# EAGLE design RedBoard-Qwiic1 (EAGLE 9.6.2)
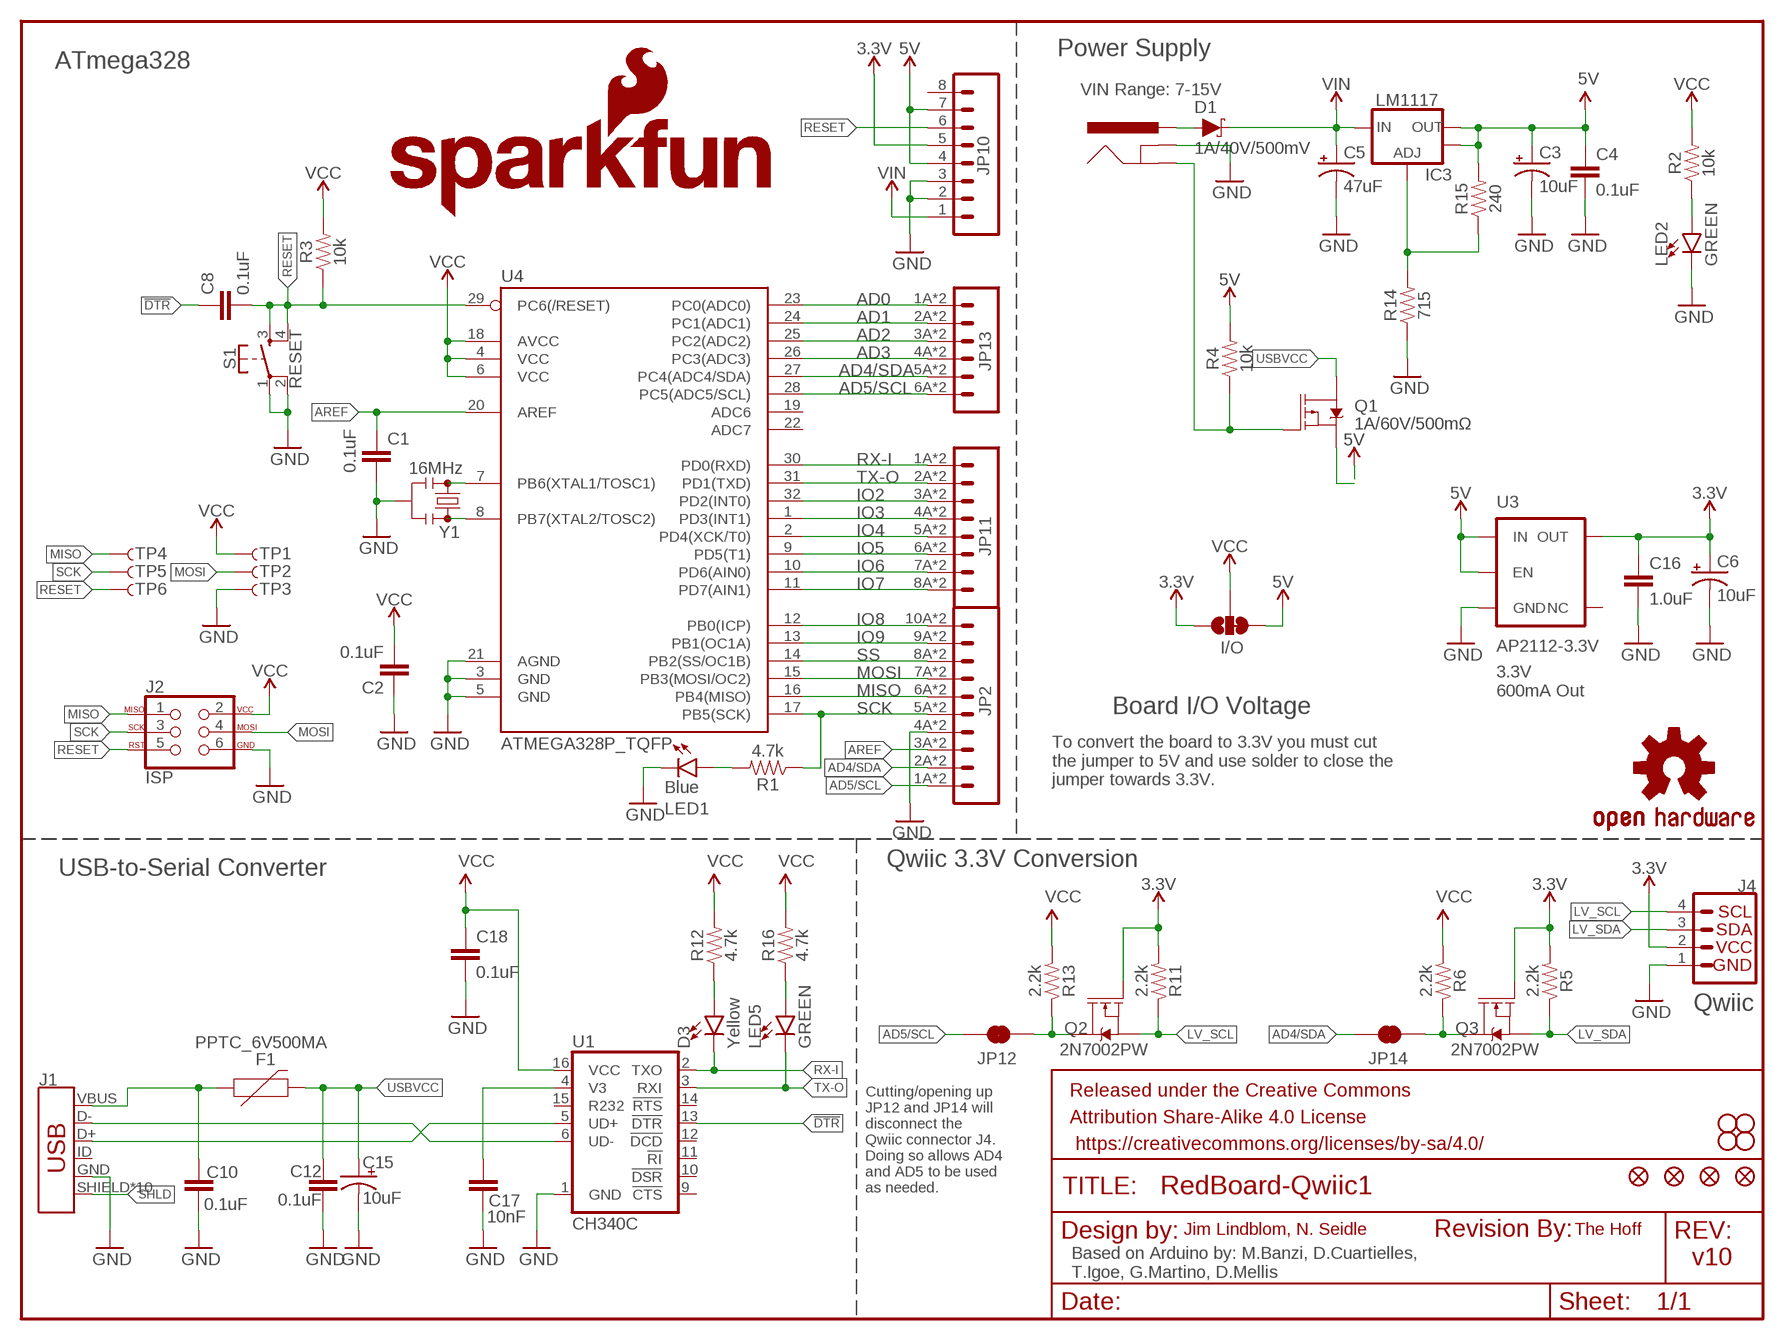
[diagram p0: schematic, sheet 1]

## Parts
C1  0.1uF  0.1UF-0603-25V-(+80/-20%)  [0603]
C2  0.1uF  0.1UF-0603-25V-(+80/-20%)  [0603]
C3  10uF  10UF-POLAR-EIA3216-16V-10%(TANT)  [EIA3216]
C4  0.1uF  0.1UF-0603-25V-(+80/-20%)  [0603]
C5  47uF  47UF-POLAR-PANASONIC_D-35V-20%  [PANASONIC_D]
C6  10uF  10UF-POLAR-EIA3216-16V-10%(TANT)  [EIA3216]
C8  0.1uF  0.1UF-0603-25V-(+80/-20%)  [0603]
C10  0.1uF  0.1UF-0603-25V-(+80/-20%)  [0603]
C12  0.1uF  0.1UF-0603-25V-(+80/-20%)  [0603]
C15  10uF  10UF-POLAR-EIA3216-16V-10%(TANT)  [EIA3216]
C16  1.0uF  1.0UF-16V-10%(0603)  [0603-CAP]
C17  10nF  10NF/10000PF-50V-10%(0603)  [0603-CAP]
C18  0.1uF  0.1UF-0603-25V-(+80/-20%)  [0603]
D1  1A/40V/500mV  DIODE-SCHOTTKY-SS14  [SMA-DIODE]
D3  Yellow  LED-YELLOW_HIDDENSILK  [LED-1206-HIDDENSILK]
F1  PPTC_6V500MA  [0805]
FRAME2  FRAME-LETTER  [CREATIVE_COMMONS]
I/O  JUMPER-SMT_3_1-NC_TRACE_SILK  [SMT-JUMPER_3_1-NC_TRACE_SILK]
IC3  LM1117  V_REG_LM1117ALT1  [SOT223-ALT1]
J1  AMP FCI 10103594-0001LF  USB_MICRO-B_HALF_PTH_MILL  [USB-MICROB-PTH-MILL]
J2  ISP  AVR_SPI_PROG_3X2SMD  [2X3_SMT_POSTS]
J3  POWER_JACKSUPER_BOMB_DIGITY  [POWER_JACK_SMD_OVERPASTE_SUPER_BOMB_DIGITY]
J4  QWIIC_CONNECTORJS-1MM  [1X04_1MM_RA]
JP1  SFE_LOGO_NAME.1_INCH  [SFE_LOGO_NAME_.1]
JP2  M10SMD_COMBO  [1X10_SMD_COMBINED]
JP3  STAND-OFF  [STAND-OFF]
JP4  STAND-OFF  [STAND-OFF]
JP5  STAND-OFF  [STAND-OFF]
JP6  STAND-OFF  [STAND-OFF]
JP7  SFE_LOGO_FLAME.1_INCH  [SFE_LOGO_FLAME_.1]
JP8  FIDUCIAL1X2  [FIDUCIAL-1X2]
JP9  FIDUCIAL1X2  [FIDUCIAL-1X2]
JP10  CONN_08SMD-COMBO-FEMALE  [1X08_SMD_COMBINED]
JP11  JP11  M08SMD-COMBO  [1X08_SMD_COMBINED@1]
JP12  JUMPER-SMT_2_NC_TRACE_SILK  [SMT-JUMPER_2_NC_TRACE_SILK]
JP13  M06SMD-STRAIGHT-COMBO  [1X06_SMD_STRAIGHT_COMBO]
JP14  JUMPER-SMT_2_NC_TRACE_SILK  [SMT-JUMPER_2_NC_TRACE_SILK]
JP15  FIDUCIAL1X2  [FIDUCIAL-1X2]
JP16  FIDUCIAL1X2  [FIDUCIAL-1X2]
LED1  Blue  LED-BLUE_HIDDENSILK  [LED-1206-HIDDENSILK]
LED2  GREEN  LED-GREEN_HIDDENSILK  [LED-1206-HIDDENSILK]
LED5  GREEN  LED-GREEN_HIDDENSILK  [LED-1206-HIDDENSILK]
LOGO1  REVISION  [REVISION]
Q1  1A/60V/500mΩ  MOSFET-PCH-ZXMP6A13F  [SOT23-3]
Q2  2N7002PW  MOSFET-NCH-2N7002PW  [SOT323]
Q3  2N7002PW  MOSFET-NCH-2N7002PW  [SOT323]
R1  4.7k  4.7KOHM-0603-1/10W-1%  [0603]
R2  10k  10KOHM-0603-1/10W-1%  [0603]
R3  10k  10KOHM-0603-1/10W-1%  [0603]
R4  10k  10KOHM-0603-1/10W-1%  [0603]
R5  2.2k  2.2KOHM-0603-1/10W-1%  [0603]
R6  2.2k  2.2KOHM-0603-1/10W-1%  [0603]
R11  2.2k  2.2KOHM-0603-1/10W-1%  [0603]
R12  4.7k  4.7KOHM-0603-1/10W-1%  [0603]
R13  2.2k  2.2KOHM-0603-1/10W-1%  [0603]
R14  715  715OHM-0603-1/10W-1%  [0603]
R15  240  240OHM-0603-1/10W-1%  [0603]
R16  4.7k  4.7KOHM-0603-1/10W-1%  [0603]
S1  RESET  MOMENTARY-SWITCH-SPST-2-SMD-5.2MM-TALL  [TACTILE_SWITCH_SMD_5.2MM]
TP1  TP-3x5  TEST-POINT3X5  [PAD.03X.05]
TP2  TP-3x5  TEST-POINT3X5  [PAD.03X.05]
TP3  TP-3x5  TEST-POINT3X5  [PAD.03X.05]
TP4  TP-3x5  TEST-POINT3X5  [PAD.03X.05]
TP5  TP-3x5  TEST-POINT3X5  [PAD.03X.05]
TP6  TP-3x5  TEST-POINT3X5  [PAD.03X.05]
U1  CH340C  [SO016]
U3  AP2112-3.3V  V_REG_AP2112K-3.3V  [SOT23-5]
U4  ATMEGA328P_TQFP  [TQFP32-08]
U$16  OSHW-LOGOS  [OSHW-LOGO-S]
Y1  16MHz  RESONATOR-16MHZSMD_3.2X1.3  [RESONATOR-SMD-3.2X1.3]

## Nets
3.3V: C6.+ C16.1 I/O.1 J4.2 JP10.5 Q2.1(G) Q3.1(G) R5.2 R11.2 U3.5(OUT)
5V: C3.+ C4.1 I/O.3 IC3.2(OUT) IC3.4(OUT) JP10.4 JP10.7 Q1.2(S) R4.2 R15.2 U3.1(IN) U3.3(EN)
!DTR: C8.1 U1.13(!DTR)
AD0: JP13.1A JP13.1B U4.23(PC0(ADC0))
AD1: JP13.2A JP13.2B U4.24(PC1(ADC1))
AD2: JP13.3A JP13.3B U4.25(PC2(ADC2))
AD3: JP13.4A JP13.4B U4.26(PC3(ADC3))
AD4/SDA: JP2.2A JP2.2B JP13.5A JP13.5B JP14.2 U4.27(PC4(ADC4/SDA))
AD5/SCL: JP2.1A JP2.1B JP12.2 JP13.6A JP13.6B U4.28(PC5(ADC5/SCL))
AREF: C1.1 JP2.3A JP2.3B U4.20(AREF)
GND: C1.2 C2.1 C3.- C4.2 C5.- C6.- C10.2 C12.2 C15.- C16.2 C17.2 C18.2 J1.GND J2.6 J3.GND(GNDBREAK) J4.1 JP2.4A JP2.4B JP10.2 JP10.3 LED1.C LED2.C R14.1 S1.1 S1.2 TP3.P$1 U1.1(GND) U3.2(GND) U4.3(GND) U4.5(GND) U4.21(AGND) Y1.2
INSERT: J3.P$4(GND) Q1.1(G) R4.1
IO2: JP11.3A JP11.3B U4.32(PD2(INT0))
IO3: JP11.4A JP11.4B U4.1(PD3(INT1))
IO4: JP11.5A JP11.5B U4.2(PD4(XCK/T0))
IO5: JP11.6A JP11.6B U4.9(PD5(T1))
IO6: JP11.7A JP11.7B U4.10(PD6(AIN0))
IO7: JP11.8A JP11.8B U4.11(PD7(AIN1))
IO8: JP2.10A JP2.10B U4.12(PB0(ICP))
IO9: JP2.9A JP2.9B U4.13(PB1(OC1A))
LV_SCL: J4.4 Q2.2(S) R11.1
LV_SDA: J4.3 Q3.2(S) R5.1
MISO: J2.1 JP2.6A JP2.6B TP4.P$1 U4.16(PB4(MISO))
MOSI: J2.4 JP2.7A JP2.7B TP2.P$1 U4.15(PB3(MOSI/OC2))
N$1: LED1.A R1.2
N$2: LED2.A R2.1
N$3: U4.7(PB6(XTAL1/TOSC1)) Y1.1
N$4: U4.8(PB7(XTAL2/TOSC2)) Y1.3
N$5: LED5.A R16.1
N$6: C17.1 U1.4(V3)
N$7: JP12.1 Q2.3(D) R13.1
N$8: JP14.1 Q3.3(D) R6.1
N$9: D3.A R12.1
N$13: J1.D- U1.6(UD-)
N$14: J1.D+ U1.5(UD+)
N$15: IC3.1(ADJ) R14.2 R15.1
PWRIN: D1.A J3.VIN0(PWR)
RESET: C8.2 J2.5 JP10.6 R3.1 S1.3 S1.4 TP6.P$1 U4.29(PC6(/RESET))
RX-I: D3.C JP11.1A JP11.1B U1.2(TXO) U4.30(PD0(RXD))
SCK: J2.3 JP2.5A JP2.5B R1.1 TP5.P$1 U4.17(PB5(SCK))
SHLD: J1.SHIELD J1.SHIELD2(SHIELD) J1.SHIELD3(SHIELD) J1.SHIELD4(SHIELD) J1.SHIELD5(SHIELD) J1.SHIELD6(SHIELD) J1.SHIELD7(SHIELD) J1.SHIELD8(SHIELD) J1.SHIELD9(SHIELD) J1.SHIELD10(SHIELD)
SS: JP2.8A JP2.8B U4.14(PB2(SS/OC1B))
TX-O: JP11.2A JP11.2B LED5.C U1.3(RXI) U4.31(PD1(TXD))
USBVCC: C12.1 C15.+ F1.2 Q1.3(D)
VCC: C2.2 C18.1 I/O.2 J2.2 R2.2 R3.2 R6.2 R12.2 R13.2 R16.2 TP1.P$1 U1.16(VCC) U4.4(VCC) U4.6(VCC) U4.18(AVCC)
VIN: C5.+ D1.C IC3.3(IN) JP10.1
VUSB: C10.1 F1.1 J1.VBUS
Unconnected: J1.ID JP10.8 U1.9(!CTS) U1.10(!DSR) U1.11(!RI) U1.12(!DCD) U1.14(!RTS) U1.15(R232) U3.4(NC) U4.19(ADC6) U4.22(ADC7)

## Notes on the sheet
- Power Supply
- ATmega328
- VIN Range: 7-15V
- 3.3V
  600mA Out
- Board I/O Voltage
- To convert the board to 3.3V you must cut
  the jumper to 5V and use solder to close the
  jumper towards 3.3V.
- Qwiic 3.3V Conversion
- USB-to-Serial Converter
- Qwiic
- Cutting/opening up
  JP12 and JP14 will 
  disconnect the 
  Qwiic connector J4.  
  Doing so allows AD4 
  and AD5 to be used
  as needed.
- Jim Lindblom, N. Seidle | The Hoff
- v10
- Based on Arduino by: M.Banzi, D.Cuartielles, 
  T.Igoe, G.Martino, D.Mellis

## Library data of the parts
C1 C2 C4 C8 C10 C12 C18 = SparkFun-Capacitors:0.1UF: 0.1µF ceramic capacitors A capacitor is a passive two-terminal electrical component used to store electrical energy temporarily in an electric field.; PROD_ID: CAP-00810
C3 C6 C15 = SparkFun-Capacitors:10UF-POLAR: 10.0µF polarized capacitors A capacitor is a passive two-terminal electrical component used to store electrical energy temporarily in an electric field.; PROD_ID: CAP-00811
C5 = SparkFun-Capacitors:47UF-POLAR: 47µF polarized capacitors A capacitor is a passive two-terminal electrical component used to store electrical energy temporarily in an electric field.; PROD_ID: CAP-08478
C16 = SparkFun-Capacitors:1.0UF-16V-10%(0603): CAP-00868; PROD_ID: CAP-00868
C17 = SparkFun-Capacitors:10NF/10000PF-50V-10%(0603): CAP-00867; PROD_ID: CAP-00867
D1 = SparkFun-DiscreteSemi:DIODE-SCHOTTKY: Schottky diode A Schottky diode is a semiconductor diode which has a low forward voltage drop and a very fast switching action.; PROD_ID: DIO-08053
D3 = SparkFun-LED:LED-YELLOW: Yellow SMD LED Used in manufacturing several products at SparkFun. Packages: 0603 - SMD 0603 package[Product Link] <http://www.kingbrightusa.com/product.asp?catalog_name=LED&product_id=APT1608SYCK> 0603 -SMART - SMART SMD 0603 package (more efficient/more expensive) [Product Link] <http://www.osram-os.com/osram_os/en/products/product-catalog/led-light-emitting-diodes/smartled-0603/ly-l29k/index.jsp> LilyPad - SMD1206 package[Product Datasheet] <https://www.sparkfun.com/datasheets/DevTools/LilyPad/Q150YUS4.pdf> SparkFun Products: Blynk Board <https://www.sparkfun.com/products/13794> IOIO-OTG <https://www.sparkfun.com/products/13613> XBee Explorer Serial <https://www.sparkfun.com/products/13225>; PROD_ID: DIO-09909
F1 = SparkFun-Fuses:PPTC: Resettable Fuse PPTC Resettable Fuse. Really a sort of resistor with a polymeric positive temperature coefficient whose resistance increases dramatically with an increase in temperature. When heated by the power passing through the resistance rises causing the current to be limited, protecting the circuit. This is achieved by the transition of the polymer from a crystalline to an amorphous state where the conductive carbon separates breaking the conductive pathways found in the cool crystalline structure. When a PPTC cools back down it resumes conducting letting the circuit turn back on. SparkFun Products: SparkFun RedBoard - Programmed with Arduino Pro Micro - 5V/16MHz Arduino Pro 328 - 5V/16MHz MP3 Trigger
FRAME2 = SparkFun-Aesthetics:FRAME-LETTER: Schematic Frame - Letter Standard 8.5x11 US Letter frame
I/O = SparkFun-Jumpers:JUMPER-SMT_3_1-NC_TRACE: Normally closed trace jumper (1 of 2 connections) This jumper has a trace between two pads so it's normally closed (NC). The other connection is normally open (NO). Use a razor knife to open the connection. For best results follow the IPC guidelines for cutting traces: Cutout at least 0.063 mm (0.005 in). Remove all loose material to clean up the cut area. Seal the cut with an approved epoxy. Reapply solder to reclose the connection, or to close the NO connection.
IC3 = Testing:V_REG_LM1117: Voltage Regulator LM1117 Standard adjustable voltage regulator but in SMD form. Spark Fun Electronics SKU : COM-00595; PROD_ID: VREG-08170
J1 = SparkFun-Connectors:USB_MICRO-B: USB Type Micro-B Connector Male/female and PTH/SMT variants SparkFun Products: SparkFun microB USB Breakout <https://www.sparkfun.com/products/12035> SparkFun USB microB Plug Breakout <https://www.sparkfun.com/products/10031> SparkFun ESP8266 Thing <https://www.sparkfun.com/products/13231>; PROD_ID: CONN-13711
J2 = SparkFun-Connectors:AVR_SPI_PROG_3X2: AVR ISP 6 Pin This is the reduced ISP connector for AVR programming. Common on Arduino. This footprint will take up less PCB space and can be used with a 10-pin to 6-pin adapter such as SKU: BOB-08508 **Special note about "TEST_POINT" package. The stop mask is on the top side, so if you want your programming test points to be on the bottom of your board, make sure to place this package on the bottom side of the board. This also ensure that the orientation to program from the bottom side will be correct.; PROD_ID: CONN-11415
J3 = Testing:POWER_JACK: Power Jack This is the standard 5.5mm barrel jack for power. The PTH is the most common, proven, reliable, footprint. All others are experimental. The Slot footprint only works if the mill layer is transmitted to the PCB fab house so be warned. Spark Fun Electronics SKU : PRT-00119. Mating wall wart : TOL-00298 (and others); PROD_ID: CONN-08106
J4 = SparkFun-Connectors:QWIIC_CONNECTOR: SparkFun I2C Standard Qwiic Connector An SMD 1mm pitch JST connector makes it easy and quick (get it? Qwiic?) to connect I2C devices to each other. The Qwiic system <http://www.sparkfun.com/qwiic> enables fast and solderless connection between popular platforms and various sensors and actuators. We carry 200mm <https://www.sparkfun.com/products/14204>, 100mm <https://www.sparkfun.com/products/14205>, 50mm <https://www.sparkfun.com/products/14206>, and breadboard friendly <https://www.sparkfun.com/products/14207> Qwiic cables. We also offer 10 pcs strips <https://www.sparkfun.com/products/14323> the SMD connectors.; PROD_ID: CONN-13694
JP1 = SparkFun-Aesthetics:SFE_LOGO_NAME: SFE Logo, name only This is the SparkFun name logo. The logo on the schematic will always be the same size; the package variant is the height of the flame part of the logo (or the height the flame would be, if it were drawn). Default layer for the logo on the board is tSilk.
JP2 = SparkFun-Connectors:M10: Header 10 Standard 10-pin 0.1" header. Use with straight break away headers (SKU : PRT-00116), right angle break away headers (PRT-00553), swiss pins (PRT-00743), machine pins (PRT-00117), and female headers (PRT-00115).; PROD_ID: CONN-11219
JP3-JP6 = SparkFun:STAND-OFF: Stand Off This is the mechanical footprint for a #4 phillips button head screw. Use the keepout ring to avoid running the screw head into surrounding components. SKU : PRT-00447
JP7 = SparkFun-Aesthetics:SFE_LOGO_FLAME: SFE Logo, flame only This is the SparkFun flame logo. The logo on the schematic will always be the same size; the package variant is the height of the flame. Default layer for the logo on the board is tSilk.
JP8 JP9 JP15 JP16 = SparkFun:FIDUCIAL: Fiducial Alignment Points Various fiducial points for machine vision alignment.
JP10 = SparkFun-Connectors:CONN_08: Multi connection point. Often used as Generic Header-pin footprint for 0.1 inch spaced/style header connections On any of the 0.1 inch spaced packages, you can populate with these: Break Away Headers - Straight (PRT-00116) Break Away Male Headers - Right Angle (PRT-00553) Female Headers (PRT-00115) Break Away Headers - Machine Pin (PRT-00117) Break Away Female Headers - Swiss Machine Pin (PRT-00743) Arduino Stackable Header - 8 Pin (PRT-09279) For SCREWTERMINALS and SPRING TERMINALS visit here: Screw Terimnals on SparkFun.com (5mm/3.5mm/2.54mm spacing) This device is also useful as a general connection point to wire up your design to another part of your project. Our various solder wires solder well into these plated through hole pads. Hook-Up Wire - Assortment (Stranded, 22 AWG) (PRT-11375) Hook-Up Wire - Assortment (Solid Core, 22 AWG) (PRT-11367) View the entire wire category on our website here Special notes: Molex polarized connector foot print use with SKU : PRT-08231 with associated crimp pins and housings. 1MM SMD Version SKU: PRT-10208 NOTES ON THE VARIANTS LOCK and LOCK_LONGPADS... This footprint was designed to help hold the alignment of a through-hole component (i.e. 6-pin header) while soldering it into place. You may notice that each hole has been shifted either up or down by 0.005 of an inch from it's more standard position (which is a perfectly straight line). This slight alteration caused the pins (the squares in the middle) to touch the edges of the holes. Because they are alternating, it causes a "brace" to hold the component in place. 0.005 has proven to be the perfect amount of "off-center" position when using our standard breakaway headers. Although looks a little odd when you look at the bare footprint, once you have a header in there, the alteration is very hard to notice. Also,if you push a header all the way into place, it is covered up entirely on the bottom side.; PROD_ID: CONN-10204; SF_ID: PRT-11543
JP11 = SparkFun-Connectors:M08: Header 8 Standard 8-pin 0.1" header. Use with straight break away headers (SKU : PRT-00116), right angle break away headers (PRT-00553), swiss pins (PRT-00743), machine pins (PRT-00117), and female headers (PRT-00115).; PROD_ID: CONN-10204
JP12 JP14 = SparkFun-Jumpers:JUMPER-SMT_2_NC_TRACE: Normally closed trace jumper This jumper has a trace between two pads so it's normally closed (NC). Use a razor knife to open the connection. For best results follow the IPC guidelines for cutting traces: Cutout at least 0.063 mm (0.005 in). Remove all loose material to clean up the cut area. Seal the cut with an approved epoxy. Reapply solder to reclose the connection.
JP13 = SparkFun-Connectors:M06: Header 6 Standard 6-pin 0.1" header. Use with straight break away headers (SKU : PRT-00116), right angle break away headers (PRT-00553), swiss pins (PRT-00743), machine pins (PRT-00117), and female headers (PRT-00115). Molex polarized connector foot print use with SKU : PRT-08094 with associated crimp pins and housings. NOTES ON THE VARIANTS LOCK and LOCK_LONGPADS... This footprint was designed to help hold the alignment of a through-hole component (i.e. 6-pin header) while soldering it into place. You may notice that each hole has been shifted either up or down by 0.005 of an inch from it's more standard position (which is a perfectly straight line). This slight alteration caused the pins (the squares in the middle) to touch the edges of the holes. Because they are alternating, it causes a "brace" to hold the component in place. 0.005 has proven to be the perfect amount of "off-center" position when using our standard breakaway headers. Although looks a little odd when you look at the bare footprint, once you have a header in there, the alteration is very hard to notice. Also,if you push a header all the way into place, it is covered up entirely on the bottom side. This idea of altering the position of holes to aid alignment will be further integrated into the Sparkfun Library for other footprints. It can help hold any component with 3 or more connection pins.; PROD_ID: CONN-10203
LED1 = SparkFun-LED:LED-BLUE: Blue SMD LED Used in manufacturing of various products at SparkFun Packages: 0603 - SMD 0603 package [Product Link] <http://www.digikey.com/product-detail/en/SMLE12BC7TT86/511-1589-2-ND/1641808> 1206 - SMD1206 package [Product Link] <http://www.digikey.com/product-detail/en/lite-on-inc/LTST-C150TBKT/160-1643-1-ND/573584> SparkFun Products: ESP8266 Thing-Dev Board <https://www.sparkfun.com/products/13711> RedBoard <https://www.sparkfun.com/products/12757>; PROD_ID: DIO-09911
LED2 = SparkFun-LED:LED-GREEN: Green SMD LED Used in manufacturing of various products at SparkFun Packages: 0603 - SMD 0603 package [Product Link] <http://www.futureelectronics.com/en/technologies/semiconductors/optoelectronics/leds/Pages/9894312-LTST-C190GKT.aspx?CrossPart=HSMG-C190&IM=0> LilyPad 1206 - SMD1206 LilyPad package [Product Link] <http://www.futureelectronics.com/en/Technologies/Product.aspx?ProductID=IN150NGHARVATEKCORPORATION2049943&IM=0> 1206 - SMD1206 package [Product Link] <http://www.futureelectronics.com/en/technologies/semiconductors/optoelectronics/leds/Pages/8315665-LTST-C150KGKT.aspx?IM=0> 1206 Bottom Mount -SMD 1206 Bottom Mount [Product Link] <http://www.digikey.com/product-detail/en/lite-on-inc/LTST-C230KGKT/160-1456-1-ND/386854> SparkFun Products: Pro Mini 328 -5V <https://www.sparkfun.com/products/821> RedBoard <https://www.sparkfun.com/products/12757> MP3 Trigger <https://www.sparkfun.com/products/13720> Makey Makey <https://www.sparkfun.com/products/11076>; PROD_ID: DIO-09910
LED5 = SparkFun-LED:LED-GREEN: Green SMD LED Used in manufacturing of various products at SparkFun Packages: 0603 - SMD 0603 package [Product Link] <http://www.futureelectronics.com/en/technologies/semiconductors/optoelectronics/leds/Pages/9894312-LTST-C190GKT.aspx?CrossPart=HSMG-C190&IM=0> LilyPad 1206 - SMD1206 LilyPad package [Product Link] <http://www.futureelectronics.com/en/Technologies/Product.aspx?ProductID=IN150NGHARVATEKCORPORATION2049943&IM=0> 1206 - SMD1206 package [Product Link] <http://www.futureelectronics.com/en/technologies/semiconductors/optoelectronics/leds/Pages/8315665-LTST-C150KGKT.aspx?IM=0> 1206 Bottom Mount -SMD 1206 Bottom Mount [Product Link] <http://www.digikey.com/product-detail/en/lite-on-inc/LTST-C230KGKT/160-1456-1-ND/386854> SparkFun Products: Pro Mini 328 -5V <https://www.sparkfun.com/products/821> RedBoard <https://www.sparkfun.com/products/12757> MP3 Trigger <https://www.sparkfun.com/products/13720> Makey Makey <https://www.sparkfun.com/products/11076>; PROD_ID: DIO-00862
LOGO1 = SparkFun-Aesthetics:REVISION: "Revision By" Text Preceding text for revisor documentation. Includes schematic text on "symbols" layer, and board text on tDoc.
Q1 = SparkFun-DiscreteSemi:MOSFET-PCH: P-channel MOSFETs Voltage controlled devices that allow control of high current outputs.; PROD_ID: TRANS-08285
Q2 Q3 = SparkFun-DiscreteSemi:MOSFET-NCH: N-channel MOSFETs Voltage controlled devices that allow control of high current outputs.; PROD_ID: TRANS-11151; VALUE: 310mA/60V/1.6Ω
R1 R12 R16 = SparkFun-Resistors:4.7KOHM: 4.7kΩ resistor A resistor is a passive two-terminal electrical component that implements electrical resistance as a circuit element. Resistors act to reduce current flow, and, at the same time, act to lower voltage levels within circuits. - Wikipedia; PROD_ID: RES-07857
R2-R4 = SparkFun-Resistors:10KOHM: 10kΩ resistor A resistor is a passive two-terminal electrical component that implements electrical resistance as a circuit element. Resistors act to reduce current flow, and, at the same time, act to lower voltage levels within circuits. - Wikipedia; PROD_ID: RES-00824
R5 R6 R11 R13 = SparkFun-Resistors:2.2KOHM: 2.2kΩ resistor A resistor is a passive two-terminal electrical component that implements electrical resistance as a circuit element. Resistors act to reduce current flow, and, at the same time, act to lower voltage levels within circuits. - Wikipedia; PROD_ID: RES-08272
R14 = SparkFun-Resistors:715OHM: 715Ω resistor A resistor is a passive two-terminal electrical component that implements electrical resistance as a circuit element. Resistors act to reduce current flow, and, at the same time, act to lower voltage levels within circuits.; PROD_ID: RES-07850
R15 = SparkFun-Resistors:240OHM: 240Ω resistor A resistor is a passive two-terminal electrical component that implements electrical resistance as a circuit element. Resistors act to reduce current flow, and, at the same time, act to lower voltage levels within circuits.; PROD_ID: RES-07849
S1 = SparkFun-Switches:MOMENTARY-SWITCH-SPST-2: Momentary Switch (Pushbutton) - SPST - Two Circuits Normally-open (NO) SPST momentary switches (buttons, pushbuttons). Schematic symbol includes two switch circuits. Variants SMD-4.6MMX2.8MM - 4.60mm x 2.80mm Tactile Momentary Button Switch - Used on SparkFun SAMD21 Mini Breakout SMD-5.2MM - Mini Pushbutton Switch - SMD - Used on Arduino Pro Mini; PROD_ID: SWCH-14139
TP1-TP4 TP6 = SparkFun-Connectors:TEST-POINT: Bare copper test points for troubleshooting or ICT
TP5 = SparkFun-Passives:TEST-POINT: Bare copper test points for troubleshooting or ICT
U1 = SparkFun-IC-Comms:CH340C; PROD_ID: IC-14038
U3 = SparkFun-PowerIC:V_REG_AP2112: AP2112 - 600mA CMOS LDO Regulator w/ Enable The AP2112 is CMOS process low dropout linear regulator with enable function, the regulator delivers a guaranteed 600mA (min.) continuous load current. Features Output Voltage Accuracy: ±1.5% Output Current: 600mA (Min.) Foldback Short Current Protection: 50mA Enable Function to Turn ON/OFF VOUT Low Dropout Voltage (3.3V): 250mV (Typ.) @IOUT=600mA Excellent Load Regulation: 0.2%/A (Typ.) Excellent Line Regulation: 0.02%/V (Typ.) Low Quiescent Current: 55μA (Typ.) Low Standby Current: 0.01μA (Typ.) Low Output Noise: 50μVRMS PSRR: 100Hz -65dB, 1kHz -65dB OTSD Protection Stable with 1.0μF Flexible Cap: Ceramic, Tantalum and Aluminum Electrolytic Operation Temperature Range: -40°C to 85°C ESD: MM 400V, HBM 4000V; PROD_ID: VREG-12457; VALUE: 3.3V
U4 = SparkFun-IC-Microcontroller:ATMEGA328P_TQFP; PROD_ID: IC-09069
U$16 = SparkFun-Aesthetics:OSHW-LOGO: Open Source Hardware Logo This logo indicates the piece of hardware it is found on incorporates a OSHW license and/or adheres to the definition of open source hardware found here: http://freedomdefined.org/OSHW
Y1 = SparkFun-Clocks:RESONATOR-16MHZ: 16MHz Resonator Digikey Example <http://www.digikey.com/product-detail/en/murata-electronics-north-america/CSTCE16M0V53-R0/490-1198-1-ND/584635> Frequency: 16MHz Frequency Stability: ±0.3% Frequency Tolerance: ±0.5% Capacitance: 15pF; PROD_ID: XTAL-08900

## Net classes
1 power: width 0.178 mm

## Board
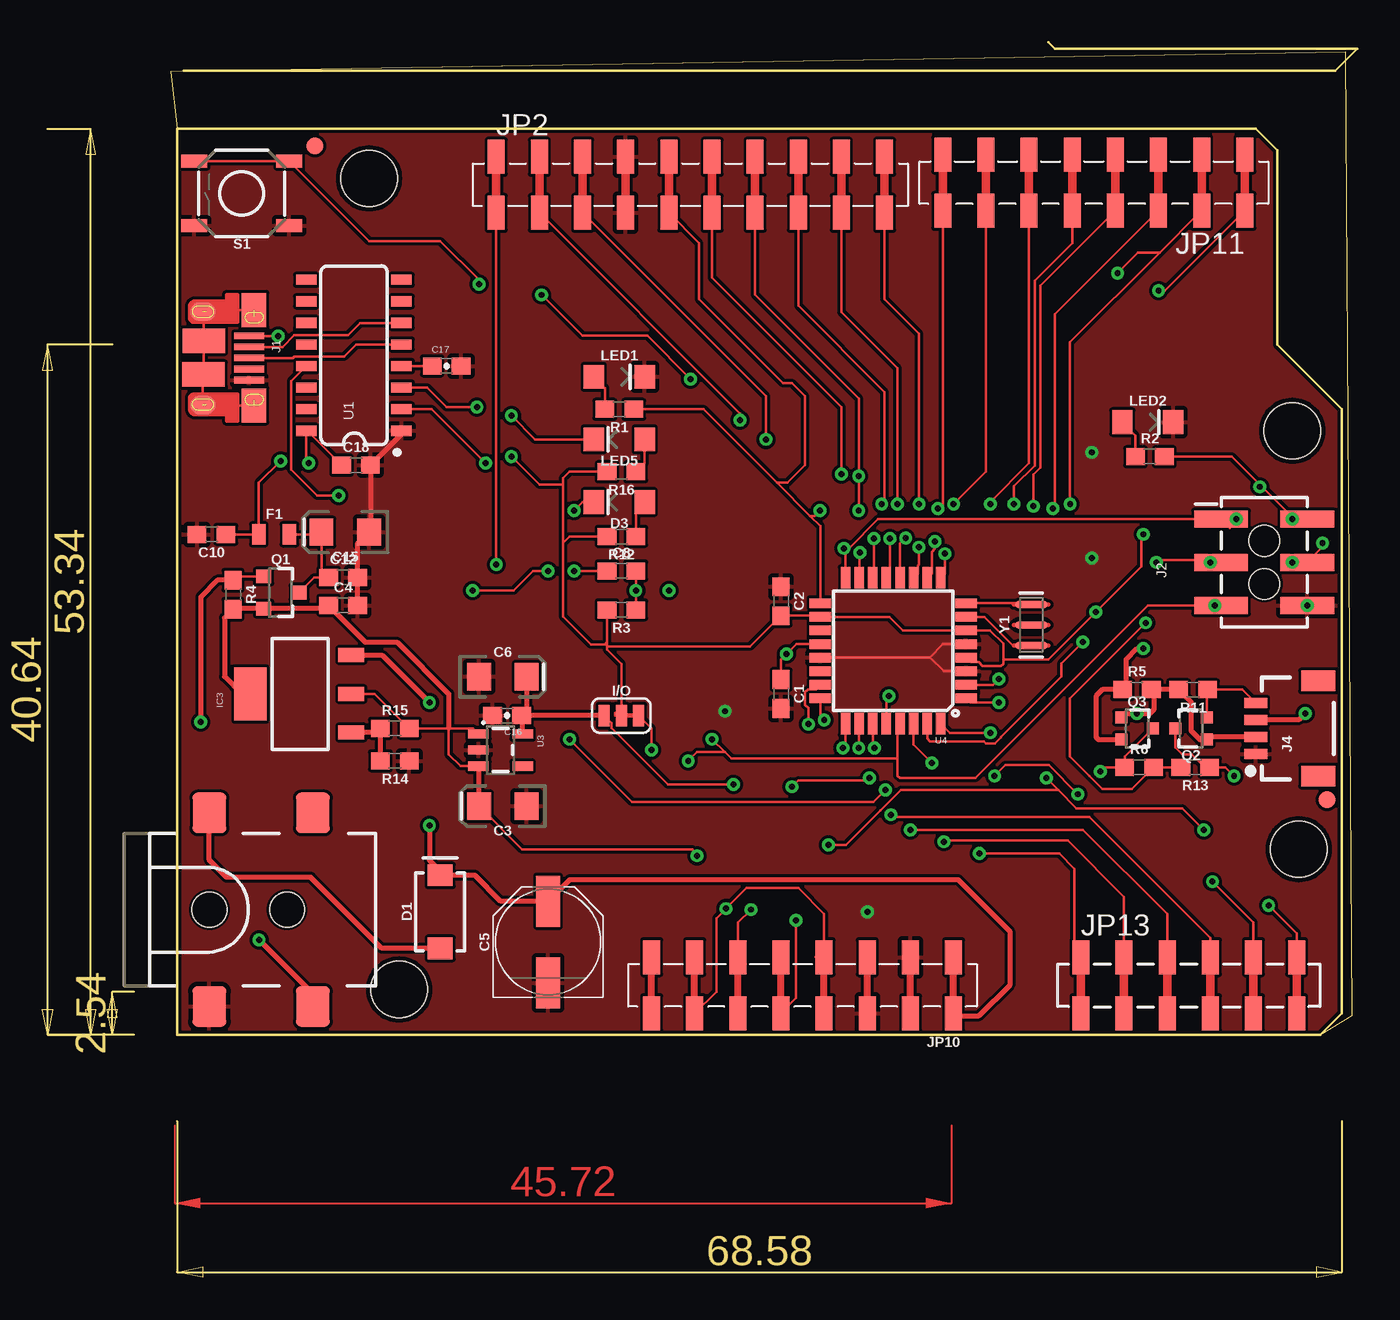
[diagram p1: board, top side]
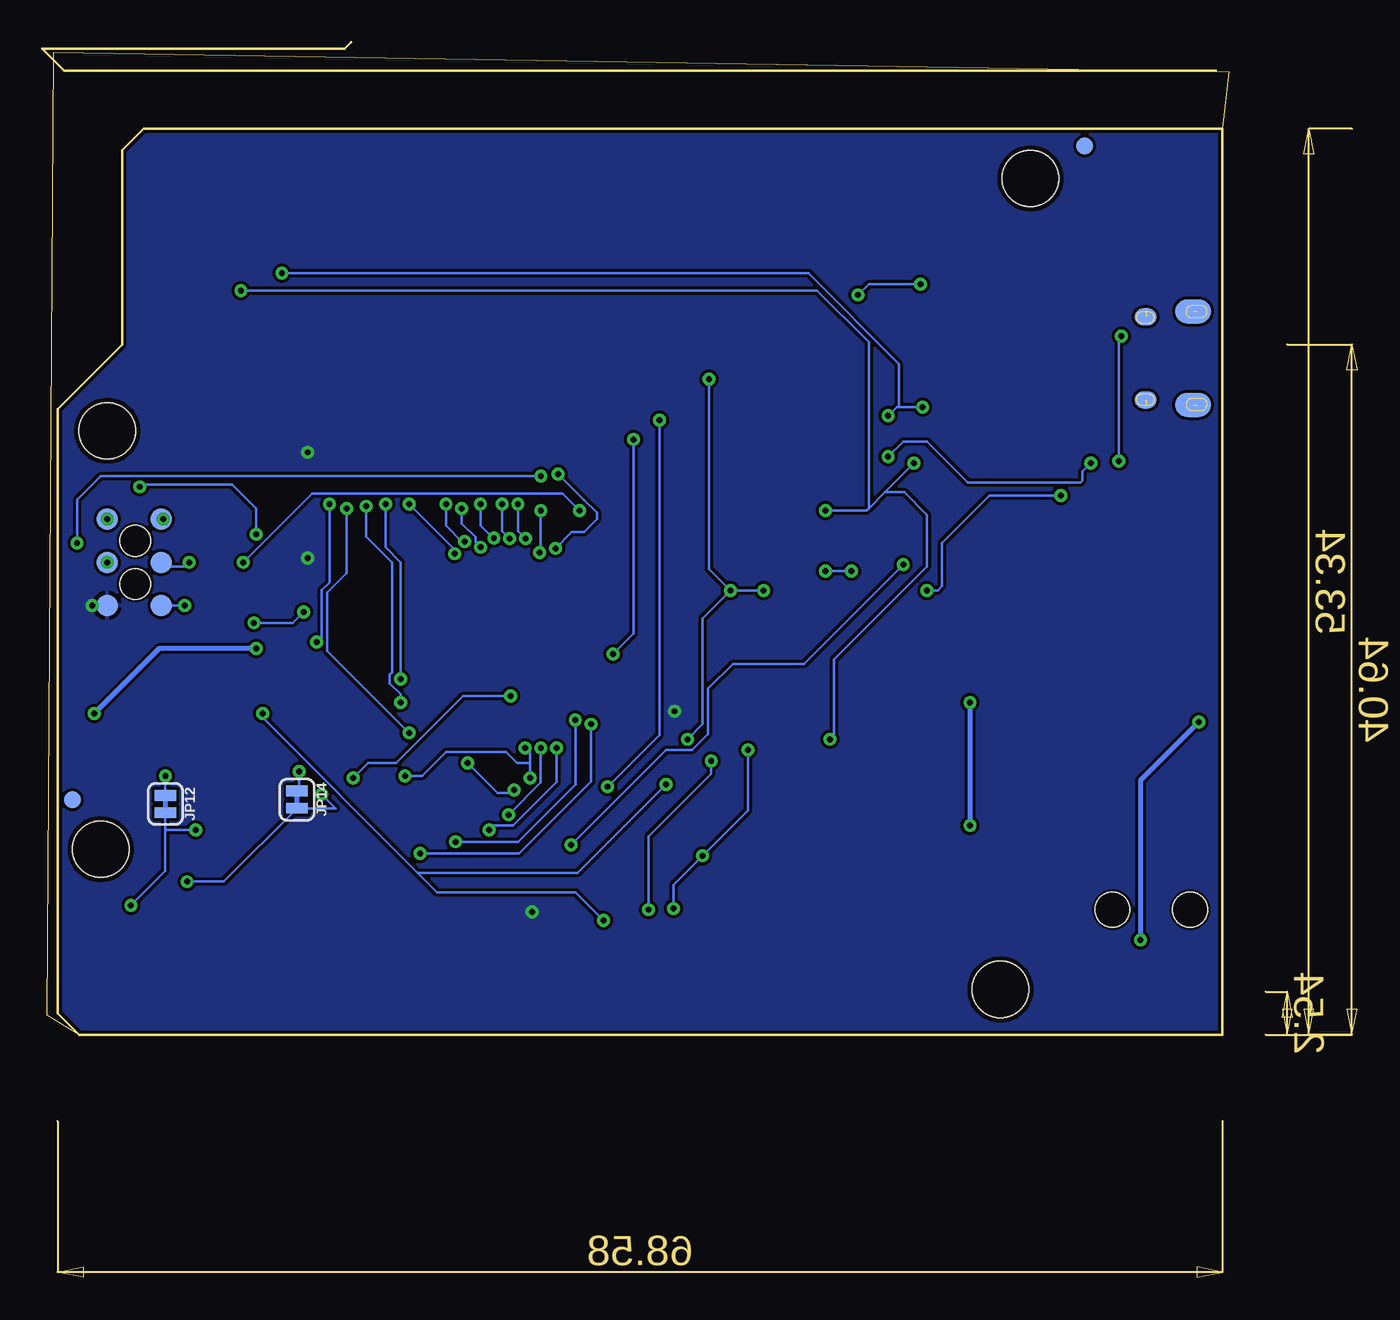
[diagram p2: board, bottom side, seen from below]

Size 69.85 x 58.42 mm. Coordinates in mm from the lower left corner, seen from the top.
Outline: 67.69,0 69.58,1.14 69.19,57.84 0,56.69 0.38,53.34
Outline: 0.38,53.34 63.88,53.34 65.15,52.07 65.15,40.64 68.96,36.83 68.96,1.27 67.69,0
Outline: 67.69,0 0.38,0 0.38,53.34
Outline: 0.76,56.77 68.58,56.77 69.85,58.04 52.07,58.04 51.69,58.42
Copper layers (1*16): Top 0.035mm / dielectric 1.5mm / Bottom 0.035mm
Design rules "default *": minimum track width 6mil, minimum drill 0.35mm, track to track 7mil, track to pad 7mil, pad to pad 7mil, via to via 7mil, smd to smd 7mil, copper to edge 7mil, drill to drill 7mil, minimum pad ring 10mil, minimum via ring 8mil, stop-mask expansion 4mil, vias tented up to drill 0mil, thermal gap 10mil

### Footprints (pad centres in the part's own frame; a part is rotated, then mirrored left to right if it is on the bottom)
0603 = smd 1.1 x 1: 1 -0.85,0; 2 0.85,0
EIA3216 = smd 1.4 x 1.6: + 1.4,0; - -1.4,0
PANASONIC_D = smd 3 x 1.4: + 2.4,0; - -2.4,0
0603-CAP = smd 1.1 x 1: 1 -0.85,0; 2 0.85,0
SMA-DIODE = smd 1.27 x 1.47: A -2.15,0; C 2.15,0
LED-1206-HIDDENSILK = smd 1.2 x 1.4: A -1.5,0; C 1.5,0
0805 = smd 0.8 x 1.2: 1 -0.9,0; 2 0.9,0
SMT-JUMPER_3_1-NC_TRACE_SILK = smd 0.635 x 1.27: 1 -1.016,0; 2 0,0; 3 1.016,0
SOT223-ALT1 = smd 0.813 x 1.524: 1 -2.271,-3.02; 2 0,-3.02; 3 2.288,-3.02 | smd 3.124 x 1.905: 4 0,2.921
USB-MICROB-PTH-MILL = smd 0.4 x 1.75: D+ 0.031,1.331; D- -0.619,1.331; GND 1.331,1.331; ID 0.681,1.331; VBUS -1.269,1.331 | smd 2 x 1.46: SHIELD -2.794,1.606; SHIELD2 2.831,1.606 | smd 1.425 x 2.5: SHIELD3 -0.979,-1.349; SHIELD4 0.996,-1.352 | smd 1.4 x 2.1 bottom: SHIELD5 -2.7,-1.2; SHIELD7 2.8,-1.2 | smd 1.1 x 1.5: SHIELD6 2.8,-1.4; SHIELD8 -2.7,-1.4 | smd 1 x 1.3 bottom: SHIELD9 -2.4,1.6; SHIELD10 2.5,1.6
2X3_SMT_POSTS = smd 1 x 3.17: 1 -2.54,-2.54; 2 -2.54,2.54; 3 0,-2.54; 4 0,2.54; 5 2.54,-2.54; 6 2.54,2.54 | hole 1.8: -1.27,0; 1.27,0
POWER_JACK_SMD_OVERPASTE_SUPER_BOMB_DIGITY = smd 2 x 2.4: GND 0,-5.7; P$4 6.1,-5.7; VIN0 0,5.7; VIN1 6.1,5.7 | hole 2.032: 0,0; 4.572,0
1X04_1MM_RA = smd 0.6 x 1.35: 1 -1.5,0; 2 -0.5,0; 3 0.5,0; 4 1.5,0 | smd 1.2 x 2: NC1 2.8,-3.675; NC2 -2.8,-3.675
1X10_SMD_COMBINED = smd 1 x 2: 1A 0,1.65; 1B 0,-1.65; 2A 2.54,1.65; 2B 2.54,-1.65; 3A 5.08,1.65; 3B 5.08,-1.65; 4A 7.62,1.65; 4B 7.62,-1.65; 5A 10.16,1.65; 5B 10.16,-1.65; 6A 12.7,1.65; 6B 12.7,-1.65; 7A 15.24,1.65; 7B 15.24,-1.65; 8A 17.78,1.65; 8B 17.78,-1.65; 9A 20.32,1.65; 9B 20.32,-1.65; 10A 22.86,1.65; 10B 22.86,-1.65
STAND-OFF = hole 3.302: 0,0
FIDUCIAL-1X2 = smd 1 x 1: 1 0,0
1X08_SMD_COMBINED = smd 1 x 2: 1 0,1.65; 1@2 0,-1.65; 2 2.54,-1.65; 2@2 2.54,1.65; 3 5.08,1.65; 3@2 5.08,-1.65; 4 7.62,-1.65; 4@2 7.62,1.65; 5 10.16,1.65; 5@2 10.16,-1.65; 6 12.7,-1.65; 6@2 12.7,1.65; 7 15.24,1.65; 7@2 15.24,-1.65; 8 17.78,-1.65; 8@2 17.78,1.65
1X08_SMD_COMBINED@1 = smd 1 x 2: 1A 0,1.65; 1B 0,-1.65; 2A 2.54,-1.65; 2B 2.54,1.65; 3A 5.08,1.65; 3B 5.08,-1.65; 4A 7.62,-1.65; 4B 7.62,1.65; 5A 10.16,1.65; 5B 10.16,-1.65; 6A 12.7,-1.65; 6B 12.7,1.65; 7A 15.24,1.65; 7B 15.24,-1.65; 8A 17.78,-1.65; 8B 17.78,1.65
SMT-JUMPER_2_NC_TRACE_SILK = smd 0.635 x 1.27: 1 -0.508,0; 2 0.508,0
1X06_SMD_STRAIGHT_COMBO = smd 1 x 2: 1A 0,-1.65; 1B 0,1.65; 2A 2.54,1.65; 2B 2.54,-1.65; 3A 5.08,-1.65; 3B 5.08,1.65; 4A 7.62,1.65; 4B 7.62,-1.65; 5A 10.16,-1.65; 5B 10.16,1.65; 6A 12.7,1.65; 6B 12.7,-1.65
SOT23-3 = smd 0.8 x 0.9: 1 -0.95,-1; 2 0.95,-1; 3 0,1.1
SOT323 = smd 0.7 x 0.7: 1 -0.65,-0.925; 2 0.65,-0.925; 3 0,0.925
TACTILE_SWITCH_SMD_5.2MM = smd 1.524 x 0.762: 1 -2.794,1.905; 2 2.794,1.905; 3 -2.794,-1.905; 4 2.794,-1.905
PAD.03X.05 = smd 1.27 x 1.27: P$1 0,0
SO016 = smd 0.6 x 1.2: 1 -4.445,-2.8; 2 -3.175,-2.8; 3 -1.905,-2.8; 4 -0.635,-2.8; 5 0.635,-2.8; 6 1.905,-2.8; 7 3.175,-2.8; 8 4.445,-2.8; 9 4.445,2.8; 10 3.175,2.8; 11 1.905,2.8; 12 0.635,2.8; 13 -0.635,2.8; 14 -1.905,2.8; 15 -3.175,2.8; 16 -4.445,2.8
SOT23-5 = smd 0.55 x 1.2: 1 -0.95,-1.3; 2 0,-1.3; 3 0.95,-1.3; 4 0.95,1.3; 5 -0.95,1.3
TQFP32-08 = smd 1.27 x 0.559: 1 -4.293,2.8; 2 -4.293,2; 3 -4.293,1.2; 4 -4.293,0.4; 5 -4.293,-0.4; 6 -4.293,-1.2; 7 -4.293,-2; 8 -4.293,-2.8; 17 4.293,-2.8; 18 4.293,-2; 19 4.293,-1.2; 20 4.293,-0.4; 21 4.293,0.4; 22 4.293,1.2; 23 4.293,2; 24 4.293,2.8 | smd 0.559 x 1.27: 9 -2.8,-4.293; 10 -2,-4.293; 11 -1.2,-4.293; 12 -0.4,-4.293; 13 0.4,-4.293; 14 1.2,-4.293; 15 2,-4.293; 16 2.8,-4.293; 25 2.8,4.293; 26 2,4.293; 27 1.2,4.293; 28 0.4,4.293; 29 -0.4,4.293; 30 -1.2,4.293; 31 -2,4.293; 32 -2.8,4.293
RESONATOR-SMD-3.2X1.3 = smd 0.45 x 1.905: 1 -1.2,0; 2 0,0; 3 1.2,0

### Placement (x,y rotation side)
C1  35.94,20.07 270 top
C2  35.94,25.53 270 top
C3  19.56,13.46 180 top
C4  10.16,25.27 0 top
C5  22.23,5.46 90 top
C6  19.56,21.08 0 top
C8  26.54,27.3 0 top
C10  2.41,29.46 180 top
C12  10.16,26.92 0 top
C15  10.29,29.59 180 top
C16  19.81,18.8 180 top
C17  16.26,39.37 0 top
C18  10.92,33.53 0 top
D1  15.88,7.24 90 top
D3  26.42,31.37 180 top
F1  6.1,29.46 0 top
FRAME2  -79.63,26.67 0 top  (outside the outline)
I/O  26.54,18.8 0 top
IC3  7.62,20.07 90 top
J1  3.3,39.88 270 top
J2  64.39,27.81 270 top
J3  2.29,7.37 0 top
J4  63.88,18.03 90 top
JP1  -46.61,53.34 0 top  (outside the outline)
JP2  19.18,50.04 0 top
JP3  13.46,2.67 0 top
JP4  66.42,10.92 0 top
JP5  66.04,35.56 0 top
JP6  11.68,50.42 0 top
JP7  -14.86,58.42 0 top  (outside the outline)
JP8  68.07,13.84 0 bottom
JP9  8.51,52.32 0 bottom
JP10  46.1,2.92 180 top
JP11  63.25,50.16 180 top
JP12  62.61,13.59 270 bottom
JP13  53.59,2.92 0 top
JP14  54.86,13.84 270 bottom
JP15  8.51,52.32 0 top
JP16  68.07,13.84 0 top
LED1  26.42,38.73 0 top
LED2  57.53,36.07 0 top
LED5  26.42,35.05 180 top
LOGO1  -51.69,58.42 0 top  (outside the outline)
Q1  6.48,26.04 270 top
Q2  60.07,18.03 90 top
Q3  56.9,18.03 270 top
R1  26.42,36.83 180 top
R2  57.66,34.04 0 top
R3  26.54,25.02 180 top
R4  3.68,25.91 270 top
R5  56.9,20.32 0 top
R6  57.02,15.75 0 top
R11  60.2,20.32 180 top
R12  26.54,29.34 180 top
R13  60.33,15.75 180 top
R14  13.21,16.13 180 top
R15  13.21,18.03 0 top
R16  26.54,33.15 180 top
S1  4.19,49.53 180 top
TP1  66.04,30.35 0 bottom
TP2  66.04,27.81 0 bottom
TP3  66.04,25.27 0 bottom
TP4  62.87,30.35 0 bottom
TP5  62.87,27.81 0 bottom
TP6  62.87,25.27 0 bottom
U1  10.79,40.01 90 top
U3  19.43,16.76 270 top
U4  42.55,22.61 180 top
U$16  -33.91,67.31 0 top  (outside the outline)
Y1  50.67,24.13 90 top

### Tracks (layer width: path | path; a pad name or v marks a point on that pad's centre or on a via)
3.3V  (via drill 0.35)
  Top 0.152: JP10.5 36.83,2.16 v36.83,6.73 | I/O.1 25.97,18.35 25.97,18.06 29.3,14.73 v33.15,14.73
  Top 0.305: I/O.1 C16.1 | U3.5 20.73,18.73 C16.1 | C6.+ 20.96,19.09 C16.1 | 57.91,20.32 R11.2 60.07,19.6 60.07,17.91 60.59,17.38 Q2.1 61.15,17.53 J4.2 | 57.91,20.32 R5.2 | Q3.1 56.21,18.92 v56.9,18.92 57.66,18.92 57.91,19.18 57.91,20.32
  Bottom 0.152: v36.83,6.73 38.48,8.38 46.61,8.38 47.75,9.53 | v56.9,18.92 56.9,18.67 47.75,9.53 | v33.15,14.73 38.35,9.53 47.75,9.53
5V  (via drill 0.35)
  Top 0.152: IC3.2 12.03,20.07 R15.2 16.38,18.03 | 16.38,18.03 17.81,18.03 U3.1 | U3.3 17.08,15.81 16.38,16.51 16.38,18.03 | JP10.7 32.13,2.54 32.13,6.86 v32.7,7.43 33.91,8.64 36.96,8.64 38.48,7.11 38.48,4.65 38.29,4.65 38.22,4.57 | 37.97,4.57 38.22,4.57 | C3.+ 20.7,10.92 30.73,10.92 30.99,10.67 v30.99,10.54 | I/O.3 28.32,18.03 v28.32,16.76 | JP10.4 38.22,4.57
  Top 0.305: C3.+ 18.16,15.79 U3.3 | IC3.4 4.19,20.07 3.17,21.08 3.17,24.55 R4.2 3.71,25.09 Q1.2 9.12,25.09 C4.1 11.47,23.11 13.34,23.11 16.38,20.07 16.38,18.03
  Bottom 0.152: v32.7,7.43 32.7,8.83 v30.99,10.54 28.32,13.21 v28.32,16.76
!DTR  (via drill 0.35)
  Top 0.152: C8.1 25.57,27.43 25.44,27.3 v23.75,27.3 | U1.13 7.11,38.49 7.11,33.27 8.64,31.75 v9.91,31.75 | v17.78,26.16 20.19,26.16 21.34,27.3 v22.23,27.3
  Bottom 0.152: v9.91,31.75 14.1,31.75 16.89,28.96 16.89,26.42 17.14,26.16 v17.78,26.16 | v22.23,27.3 v23.75,27.3
AD0  (via drill 0.35)
  Top 0.152: v47.62,10.67 52.32,10.67 53.21,9.78 53.21,4.95 53.47,4.7 JP13.1B JP13.1A | U4.23 37.99,20.34 37.51,20.34 37.36,20.19 37.36,19.42 37.55,19.24 v37.55,18.29
  Bottom 0.152: v47.62,10.67 41.78,10.67 37.55,14.9 v37.55,18.29
AD1  (via drill 0.35)
  Top 0.152: v45.53,11.37 45.59,11.3 45.72,11.43 52.83,11.43 56.13,8.13 JP13.2A JP13.2B | v38.48,18.54 38.25,18.77 U4.24
  Bottom 0.152: v45.53,11.37 41.85,11.37 38.48,14.73 v38.48,18.54
AD2  (via drill 0.35)
  Top 0.152: v43.56,12.06 53.72,12.06 58.67,7.11 58.67,4.7 JP13.3B JP13.3A | v39.58,16.89 39.74,17.05 U4.25
  Bottom 0.152: v43.56,12.06 43.3,12.32 42.16,12.32 39.58,14.9 v39.58,16.89
AD3  (via drill 0.35)
  Top 0.152: v42.42,12.95 42.55,12.83 54.1,12.83 61.21,5.71 JP13.4A JP13.4B | v40.51,16.89 40.51,18.28 U4.26
  Bottom 0.152: v42.42,12.95 40.51,14.86 v40.51,16.89
AD4/SDA  (via drill 0.35)
  Top 0.152: v61.34,9.02 63.75,6.6 JP13.5B JP13.5A | v33.53,36.2 33.53,36.58 JP2.2B JP2.2A | v36.58,14.61 36.96,14.99 41.02,14.99 v41.15,15.12 | v41.45,16.89 41.34,16.99 U4.27 | v53.41,14.16 51.69,15.88 49.15,15.88 v48.51,15.24
  Bottom 0.152: v61.34,9.02 59.18,9.02 JP14.2 52.58,13.34 v53.41,14.16 | v36.58,14.61 33.53,17.65 v33.53,36.2 | v41.15,15.12 41.15,16 | 41.15,16 41.15,16.59 v41.45,16.89 | v48.51,15.24 47.5,15.24 46.1,16.64 42.55,16.64 41.91,16 41.15,16
AD5/SCL  (via drill 0.35)
  Top 0.152: v64.64,7.62 66.29,5.97 JP13.6A JP13.6B | U4.28 42.15,19.79 v42.29,19.94 | v51.56,15.11 52.26,14.41 | 52.26,14.41 53.34,13.34 59.56,13.34 v60.83,12.06 | v38.73,11.18 39.75,11.18 41.79,13.21 41.79,13.22 42.98,14.41 52.26,14.41 | v19.18,27.69 JP2.1B JP2.1A
  Bottom 0.152: JP12.2 62.61,12.06 | 62.61,12.06 62.61,9.65 v64.64,7.62 | v42.29,19.94 45.09,19.94 49.02,16 50.67,16 v51.56,15.11 | v60.83,12.06 62.61,12.06 | v19.18,27.69 25.02,21.84 29.21,21.84 30.66,20.4 30.66,17.72 31.62,16.77 33.14,16.77 v38.73,11.18
AREF  (via drill 0.35)
  Top 0.152: C1.1 35.94,22.1 v36.26,22.42 36.85,23.01 U4.20 | v35.05,35.05 35.05,37.59 JP2.3B JP2.3A
  Bottom 0.152: v35.05,35.05 35.05,23.62 v36.26,22.42
GND  (via drill 0.35)
  Top 0.152: U4.21 38.27,22.23 44.7,22.23 | U4.5 45.48,23.01 44.7,22.23 | U4.3 45.52,21.41 44.7,22.23 | JP2.4B 26.8,47.75
  Top 0.305: C4.2 C12.2 11.01,28.91 C15.- 11.77,29.68 C18.2 13.6,35.35 U1.1
  Bottom 0.152: TP3.P$1 J2.6
  other vias: 66.93,25.27 54.23,28.07 54.23,34.29 32.64,19.05 41.02,7.24
  pour Bottom: -8.25,60.83 68.96,60.83 83.06,46.74 83.06,-5.46 72.52,-16 -5.84,-16 -15.37,-6.48 -15.37,53.72
  pour Top: -2.67,62.74 69.98,62.74 80.64,52.07 80.64,-0.25 70.48,-10.41 -6.1,-10.41 -6.48,-10.03 -12.19,-4.32 -12.19,52.83 -12.19,53.21
  pour Bottom: -1.78,65.53 69.47,65.53 85.6,49.4 85.6,-1.14 71.12,-15.62 -5.59,-15.62 -5.71,-15.49 -14.48,-6.73 -14.48,53.85 -2.79,65.53
INSERT  (via drill 0.35)
  Top 0.152: Q1.1 3.91,26.98 R4.1 | J3.P$4 8.13,1.92
  Top 0.305: 8.13,1.92 8.13,2.67 | R4.1 2.75,26.76 1.78,25.78 v1.78,18.41 | v5.21,5.59 8.39,2.41 J3.P$4
  Bottom 0.305: v1.78,18.41 5.21,14.99 v5.21,5.59
IO2  (via drill 0.35)
  Top 0.152: v51.94,30.99 52.07,31.11 52.07,42.42 JP11.3A JP11.3B | v48.26,17.78 45.88,17.78 U4.32
  Bottom 0.152: v51.94,30.99 51.94,27.18 53.09,26.04 53.09,22.61 v48.26,17.78
IO3  (via drill 0.35)
  Top 0.152: v50.8,31.11 50.8,32.98 51.21,33.38 51.21,44.09 JP11.4B JP11.4A | v48.77,19.56 47.09,19.56 U4.1
  Bottom 0.152: v50.8,31.11 50.8,29.34 49.28,27.81 49.28,21.34 49.4,21.22 49.4,20.69 48.77,20.06 v48.77,19.56
IO4  (via drill 0.35)
  Top 0.152: v48.77,20.95 48.42,20.61 U4.2 | v49.66,31.25 49.66,32.3 50.88,33.52 50.88,44.4 53.09,46.61 JP11.5A JP11.5B
  Bottom 0.152: v49.66,31.25 49.66,28.7 48.77,27.81 v48.77,20.95
IO5  (via drill 0.35)
  Top 0.152: v48.26,31.25 48.26,31.37 50.55,33.66 50.55,48.26 JP11.6B JP11.6A | v45.59,28.32 45.59,27.15 U4.9
  Bottom 0.152: v48.26,31.25 45.59,28.58 v45.59,28.32
IO6  (via drill 0.35)
  Top 0.152: v46.1,31.24 48.01,33.15 JP11.7A JP11.7B | v45,29.05 45,28.62 44.81,28.43 44.81,27.16 U4.10
  Bottom 0.152: v46.1,31.24 46.1,29.97 45.09,28.96 v45,29.05
IO7  (via drill 0.35)
  Top 0.152: v45.17,30.99 45.21,30.99 45.47,31.24 JP11.8B JP11.8A | v44.06,28.7 44.06,27.69 44.01,27.64 44.01,27.16 U4.11
  Bottom 0.152: v44.06,28.7 44.36,29 44.36,29.31 45.17,30.11 v45.17,30.99
IO8  (via drill 0.35)
  Top 0.152: v44.07,31.24 44.07,41.27 42.04,43.31 JP2.10B JP2.10A | v43.28,29.24 42.95,28.91 U4.12
  Bottom 0.152: v44.07,31.24 44.07,29.97 43.31,29.21 v43.28,29.24
IO9  (via drill 0.35)
  Top 0.152: v42.8,31.24 42.8,39.24 39.5,42.55 JP2.9B JP2.9A | v42.34,29.21 42.34,27.1 U4.13
  Bottom 0.152: v42.8,31.24 42.8,29.66 v42.34,29.21
LV_SCL
  Top 0.152: J4.4 63.09,20.32 R11.1 61,20.27 Q2.2
LV_SDA  (via drill 0.35)
  Top 0.305: Q3.2 54.62,17.38 54.48,17.53 54.48,19.94 54.86,20.32 R5.1 56.26,20.54 56.26,22.1 56.9,22.73 v57.28,22.73 | v66.8,18.92 66.41,18.53 J4.3
  Bottom 0.305: v57.28,22.73 62.99,22.73 v66.8,18.92
MISO  (via drill 0.35)
  Top 0.152: v62.74,30.35 J2.1 | J2.1 41.66,30.35 39.94,28.64 | U4.16 39.74,28.44 39.94,28.64 | v39.5,33.02 39.5,36.96 31.88,44.58 JP2.6B JP2.6A | v39.65,28.64 39.94,28.64 | J2.1 61.98,30.48 62.99,30.48 62.36,29.84
  Bottom 0.152: v39.5,33.02 37.97,31.49 37.21,30.74 37.21,30.35 37.97,29.59 38.69,29.59 v39.65,28.64 | v62.74,30.35 62.8,30.29 TP4.P$1
MOSI  (via drill 0.35)
  Top 0.152: v40.51,30.86 v40.51,32.89 40.51,37.47 34.42,43.56 JP2.7B JP2.7A | v40.58,28.38 40.55,28.35 U4.15 | J2.4 66.67,27.56 66.17,27.56 | J2.4 67.82,28.7 v67.82,28.96 | J2.4 TP2.P$1
  Bottom 0.152: v40.51,30.86 40.51,28.45 v40.58,28.38 | v67.82,28.96 67.82,31.5 66.42,32.89 v40.51,32.89
  other vias: 66.04,27.81
N$1
  Top 0.152: LED1.A 25.57,38.09 R1.2
N$2
  Top 0.152: LED2.A 56.81,35.29 R2.1
N$3
  Top 0.152: U4.7 47.91,24.61 49.66,22.86 50.42,22.86 50.49,22.93 Y1.1
N$4
  Top 0.152: U4.8 50.6,25.41 Y1.3
N$5
  Top 0.152: R16.1 27.92,33.67 LED5.A
N$6
  Top 0.152: U1.4 C17.1
N$7  (via drill 0.35)
  Top 0.152: Q2.3 59.15,16.93 59.57,16.5 60.13,16.5 60.88,15.75 R13.1 62.1,15.75 v62.61,15.24
  Bottom 0.152: v62.61,15.24 JP12.1
N$8  (via drill 0.35)
  Top 0.152: Q3.3 56.17,16.39 R6.1 54.99,15.75 v54.74,15.49
  Bottom 0.152: v54.74,15.49 54.74,14.48 JP14.1
N$9
  Top 0.152: D3.A 27.39,30.85 R12.1
N$13
  Top 0.152: U1.6 11.18,41.91 10.46,41.19 7.29,41.19 6.59,40.5 J1.D-
N$14
  Top 0.152: U1.5 10.92,40.64 10.21,39.92 7.29,39.92 7.21,39.85 J1.D+
N$15
  Top 0.305: IC3.1 12.12,17.8 R15.1 R14.2
PWRIN
  Top 0.305: D1.A 12.44,5.09 8.25,9.27 3.3,9.27 2.29,10.29 J3.VIN0
RESET  (via drill 0.35)
  Top 0.152: S1.4 S1.3 11.68,46.74 15.88,46.74 18.16,44.45 v18.16,44.2 | R3.1 v27.39,26.16 C8.2 | U4.29 42.8,18.17 42.8,16.26 | 42.8,16.26 42.8,15.24 42.93,15.11 47.37,15.11 57.53,25.27 v61.47,25.27 J2.5 | 42.8,16.26 33.02,16.26 32.64,16.64 | 32.64,16.64 v31.88,17.4 | JP10.6 33.4,6.6 v34.16,7.37 | v30.48,16.13 30.99,16.64 32.64,16.64 | v21.84,43.56 24.26,41.15 28.07,41.15 v30.61,38.61
  Bottom 0.152: v31.88,17.4 30.99,18.29 30.99,24.51 v29.34,26.16 | v29.34,26.16 v27.39,26.16 | v34.16,7.37 34.16,11.68 30.48,15.37 v30.48,16.13 | v61.47,25.27 TP6.P$1 | v18.16,44.2 21.21,44.2 v21.84,43.56 | v30.61,38.61 30.61,27.43 v29.34,26.16
RX-I  (via drill 0.35)
  Top 0.152: JP11.1A 63.25,47.62 | U1.2 15.37,36.83 v18.54,33.66 | v23.75,30.86 24.25,31.37 D3.C | U4.30 43.74,17.09 v44.83,16 | v42.09,14.42 41.39,13.72 27.18,13.72 v23.5,17.4 | JP11.1A 58.55,43.81 v58.17,43.81 | JP11.1B JP11.1A
  Bottom 0.152: v18.54,33.66 20.26,31.94 | 20.26,31.94 21.21,30.99 | 21.21,30.99 21.34,30.86 v23.75,30.86 | v44.83,16 43.05,14.22 42.16,14.22 42.09,14.29 v42.09,14.42 | v23.5,17.4 23.24,17.65 23.24,22.1 17.78,27.56 17.78,30.61 19.11,31.94 20.26,31.94 | v58.17,43.81 24.26,43.81 21.21,40.77 21.21,30.99
SCK  (via drill 0.35)
  Top 0.152: R1.1 31.37,36.83 35.69,32.51 | U4.17 38.25,29.95 37.66,30.54 | 35.69,32.51 37.66,30.54 | J2.3 v61.21,27.81 61.21,27.94 58.17,27.94 v58.04,27.81 | v38.23,30.86 37.91,30.54 37.66,30.54 | 35.69,32.51 36.32,32.51 37.34,33.53 37.34,37.59 36.58,38.35 36.07,38.35 31.12,43.31 31.12,46.61 JP2.5B JP2.5A
  Bottom 0.152: v58.04,27.81 53.98,31.88 39.24,31.88 v38.23,30.86 | TP5.P$1 62.61,27.56 61.47,27.56 v61.21,27.81
SHLD  (4 unrouted)
  Top 0.152: 2.29,42.67 2,42.67 J1.SHIELD8 | J1.SHIELD2 2.16,37.05 2.13,37.08 J1.SHIELD6 1.9,38.83 J1.SHIELD4 J1.SHIELD3 1.95,42.34 2.29,42.67 | 2.29,42.67 4.83,42.67 4.83,42.42 4.91,42.5 J1.SHIELD 4.91,43.26 4.95,43.31
SS  (via drill 0.35)
  Top 0.152: v41.87,31.24 42.04,31.41 42.04,37.85 36.96,42.93 JP2.8B JP2.8A | v41.41,29.21 41.41,26.96 U4.14
  Bottom 0.152: v41.87,31.24 41.87,29.67 v41.41,29.21
TX-O  (via drill 0.35)
  Top 0.152: 58.23,46.04 60.58,48.39 JP11.2B JP11.2A | 58.23,46.04 52.96,40.77 v52.96,31.25 | v53.72,23.11 52.45,21.85 52.45,21.08 48.89,17.52 48.52,17.15 48,17.15 47.87,17.27 44.7,17.27 44.55,17.43 U4.31 | U1.3 15.11,38.1 16.26,36.96 v18.03,36.96 | v20.07,36.45 21.46,35.05 LED5.C | 58.23,46.04 56.96,46.04 v55.75,44.83
  Bottom 0.152: v52.96,31.25 52.96,26.63 53.42,26.17 53.42,23.42 v53.72,23.11 | v18.03,36.96 19.43,36.96 | 19.43,36.96 19.56,36.96 v20.07,36.45 | v55.75,44.83 24.77,44.83 19.43,39.5 19.43,36.96
USBVCC
  Top 0.152: Q1.3 8.47,26.92 C12.1 8.89,27.35 C15.+ 8.76,29.46 F1.2
VCC  (via drill 0.35)
  Top 0.152: R3.2 25.69,23.11 | 25.69,23.11 25.69,22.86 | 25.69,22.86 25.69,22.69 26.54,21.84 26.54,19.34 26.16,18.95 26.16,18.8 26.42,19.05 | 26.67,19.18 26.54,19.18 26.42,19.05 | 25.69,22.86 34.12,22.86 C2.2 38.18,24.68 U4.18 42.32,24.61 43.12,23.81 U4.6 48.24,23.81 49.02,23.03 49.02,22.1 | R12.2 23.5,29.34 23.11,28.96 | 25.69,23.11 25.57,22.99 24.77,22.99 23.11,24.64 23.11,28.96 | 23.11,32.38 23.11,32.77 23.5,33.15 R16.2 | 23.11,32.38 23.11,28.96 | R2.2 62.48,34.04 64.13,32.38 | 64.13,32.38 66.04,30.48 TP1.P$1 66.48,30.8 J2.2 | 49.02,22.1 49.02,21.84 48.9,21.72 47.8,21.72 47.58,21.94 47.1,21.94 U4.4 | R13.2 R6.2 56.6,14.48 54.86,14.48 54.1,15.23 54.1,15.24 52.96,16.38 52.96,19.81 v57.4,24.26 v57.41,24.25 | 49.02,22.1 51.69,22.1 v54.48,24.89 57.15,27.56 57.15,29.34 v57.28,29.47 | v64.13,32.26 64.13,32.38 | C18.1 8.04,35.56 U1.16 8,33.79 v8.13,33.66 | v20.07,34.04 21.72,32.38 23.11,32.38 | I/O.2 26.42,18.92 26.42,19.05
  Bottom 0.152: v57.28,29.47 57.28,30.99 58.67,32.38 64.01,32.38 v64.13,32.26 | v8.13,33.66 8.64,33.15 8.64,32.64 8.76,32.51 15.37,32.51 17.78,34.92 19.18,34.92 v20.07,34.04 | v57.41,24.25 55.12,24.25 v54.48,24.89
  other vias: 66.04,30.35
VIN  (via drill 0.35)
  Top 0.152: JP10.1 46.1,1.12
  Top 0.305: 16.13,9.39 17.92,9.39 19.44,7.86 C5.+ 23.51,9.14 46.35,9.14 49.4,6.1 49.4,2.92 47.6,1.12 46.1,1.12 | 16.13,9.39 D1.C | IC3.3 12.44,22.36 v15.24,19.56 | v15.24,12.32 15.24,10.28 16.13,9.39
  Bottom 0.305: v15.24,19.56 v15.24,12.32
VUSB  (via drill 0.35)
  Top 0.152: C10.1 F1.1 5.2,32.5 v6.48,33.78 | v6.33,41.13 4.65,41.13 J1.VBUS
  Bottom 0.152: v6.48,33.78 6.48,40.89 6.33,41.04 v6.33,41.13
(copper drawn outside any net)
  shapes: Top area x1